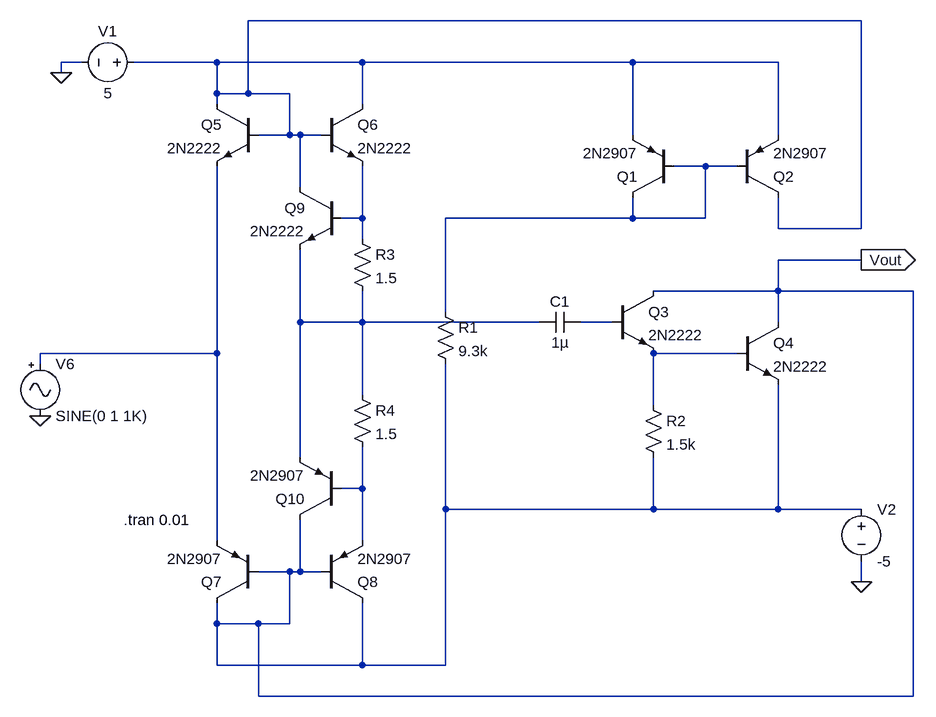
[diagram p0: schematic block2.asc]
block2.asc, the LTspice schematic file:
Version 4
SHEET 1 880 976
WIRE 368 -144 -576 -144
WIRE -832 -80 -864 -80
WIRE -624 -80 -752 -80
WIRE -400 -80 -624 -80
WIRE 16 -80 -400 -80
WIRE 240 -80 16 -80
WIRE -864 -64 -864 -80
WIRE -624 -32 -624 -80
WIRE -576 -32 -576 -144
WIRE -576 -32 -624 -32
WIRE -512 -32 -576 -32
WIRE -624 -16 -624 -32
WIRE -400 -16 -400 -80
WIRE -512 32 -512 -32
WIRE -512 32 -560 32
WIRE -496 32 -512 32
WIRE -464 32 -496 32
WIRE 16 32 16 -80
WIRE 240 32 240 -80
WIRE 128 80 80 80
WIRE 176 80 128 80
WIRE -496 112 -496 32
WIRE -400 160 -400 80
WIRE -400 160 -432 160
WIRE 16 160 16 128
WIRE 16 160 -272 160
WIRE 128 160 128 80
WIRE 128 160 16 160
WIRE 240 176 240 128
WIRE 368 176 368 -144
WIRE 368 176 240 176
WIRE -400 192 -400 160
WIRE 368 224 240 224
WIRE 240 272 240 224
WIRE 240 272 48 272
WIRE 448 272 240 272
WIRE -272 304 -272 160
WIRE -496 320 -496 208
WIRE -400 320 -400 272
WIRE -400 320 -496 320
WIRE -128 320 -400 320
WIRE -16 320 -64 320
WIRE 240 320 240 272
WIRE -624 368 -624 80
WIRE -624 368 -896 368
WIRE 176 368 48 368
WIRE -896 384 -896 368
WIRE -400 432 -400 320
WIRE 48 448 48 368
WIRE -496 528 -496 320
WIRE -400 576 -400 512
WIRE -400 576 -432 576
WIRE -272 608 -272 384
WIRE 48 608 48 528
WIRE 48 608 -272 608
WIRE 240 608 240 416
WIRE 240 608 48 608
WIRE 368 608 240 608
WIRE -624 656 -624 368
WIRE -400 656 -400 576
WIRE -512 704 -560 704
WIRE -496 704 -496 624
WIRE -496 704 -512 704
WIRE -464 704 -496 704
WIRE 368 720 368 688
WIRE -624 784 -624 752
WIRE -560 784 -624 784
WIRE -512 784 -512 704
WIRE -512 784 -560 784
WIRE -624 848 -624 784
WIRE -400 848 -400 752
WIRE -400 848 -624 848
WIRE -272 848 -272 608
WIRE -272 848 -400 848
WIRE -560 896 -560 784
WIRE 448 896 448 272
WIRE 448 896 -560 896
FLAG -864 -64 0
FLAG 368 720 0
FLAG 368 224 Vout
IOPIN 368 224 Out
FLAG -896 464 0
SYMBOL pnp 80 128 R180
SYMATTR InstName Q1
SYMATTR Value 2N2907
SYMBOL pnp 176 128 M180
SYMATTR InstName Q2
SYMATTR Value 2N2907
SYMBOL voltage -736 -80 R90
WINDOW 0 -32 56 VBottom 2
WINDOW 3 32 56 VTop 2
SYMATTR InstName V1
SYMATTR Value 5
SYMBOL res -288 288 R0
SYMATTR InstName R1
SYMATTR Value 9.3k
SYMBOL npn -16 272 R0
SYMATTR InstName Q3
SYMATTR Value 2N2222
SYMBOL npn 176 320 R0
SYMATTR InstName Q4
SYMATTR Value 2N2222
SYMBOL res 32 432 R0
SYMATTR InstName R2
SYMATTR Value 1.5k
SYMBOL voltage 368 592 R0
SYMATTR InstName V2
SYMATTR Value -5
SYMBOL cap -64 304 R90
WINDOW 0 0 32 VBottom 2
WINDOW 3 32 32 VTop 2
SYMATTR InstName C1
SYMATTR Value 1µ
SYMBOL npn -560 -16 M0
SYMATTR InstName Q5
SYMATTR Value 2N2222
SYMBOL npn -464 -16 R0
SYMATTR InstName Q6
SYMATTR Value 2N2222
SYMBOL pnp -560 752 R180
SYMATTR InstName Q7
SYMATTR Value 2N2907
SYMBOL pnp -464 752 M180
SYMATTR InstName Q8
SYMATTR Value 2N2907
SYMBOL Misc/signal -896 368 R0
SYMATTR InstName V6
SYMBOL npn -432 112 M0
SYMATTR InstName Q9
SYMATTR Value 2N2222
SYMBOL res -416 176 R0
SYMATTR InstName R3
SYMATTR Value 1.5
SYMBOL pnp -432 624 R180
SYMATTR InstName Q10
SYMATTR Value 2N2907
SYMBOL res -416 416 R0
SYMATTR InstName R4
SYMATTR Value 1.5
TEXT -768 624 Left 2 !.tran 0.01

The netlist it stands for:
* block2.asc
Q1 N002 N002 N001 0 2N2907
Q2 N001 N002 N001 0 2N2907
V1 N001 0 5
R1 N002 Vout 9.3k
Q3 Vout N005 N007 0 2N2222
Q4 Vout N007 Vout 0 2N2222
R2 N007 Vout 1.5k
V2 Vout 0 -5
C1 N005 N004 1µ
Q5 N001 N001 N006 0 2N2222
Q6 N001 N001 N003 0 2N2222
Q7 Vout Vout N006 0 2N2907
Q8 Vout Vout N008 0 2N2907
V6 N006 0 SINE(0 1 1K)
Q9 N001 N003 N004 0 2N2222
R3 N003 N004 1.5
Q10 Vout N008 N004 0 2N2907
R4 N004 N008 1.5
.model NPN NPN
.model PNP PNP
.lib standard.bjt
.tran 0.01
.backanno
.end